# Altium schematic sheet 4-Connectors.schdoc
size 314 x 222 mm
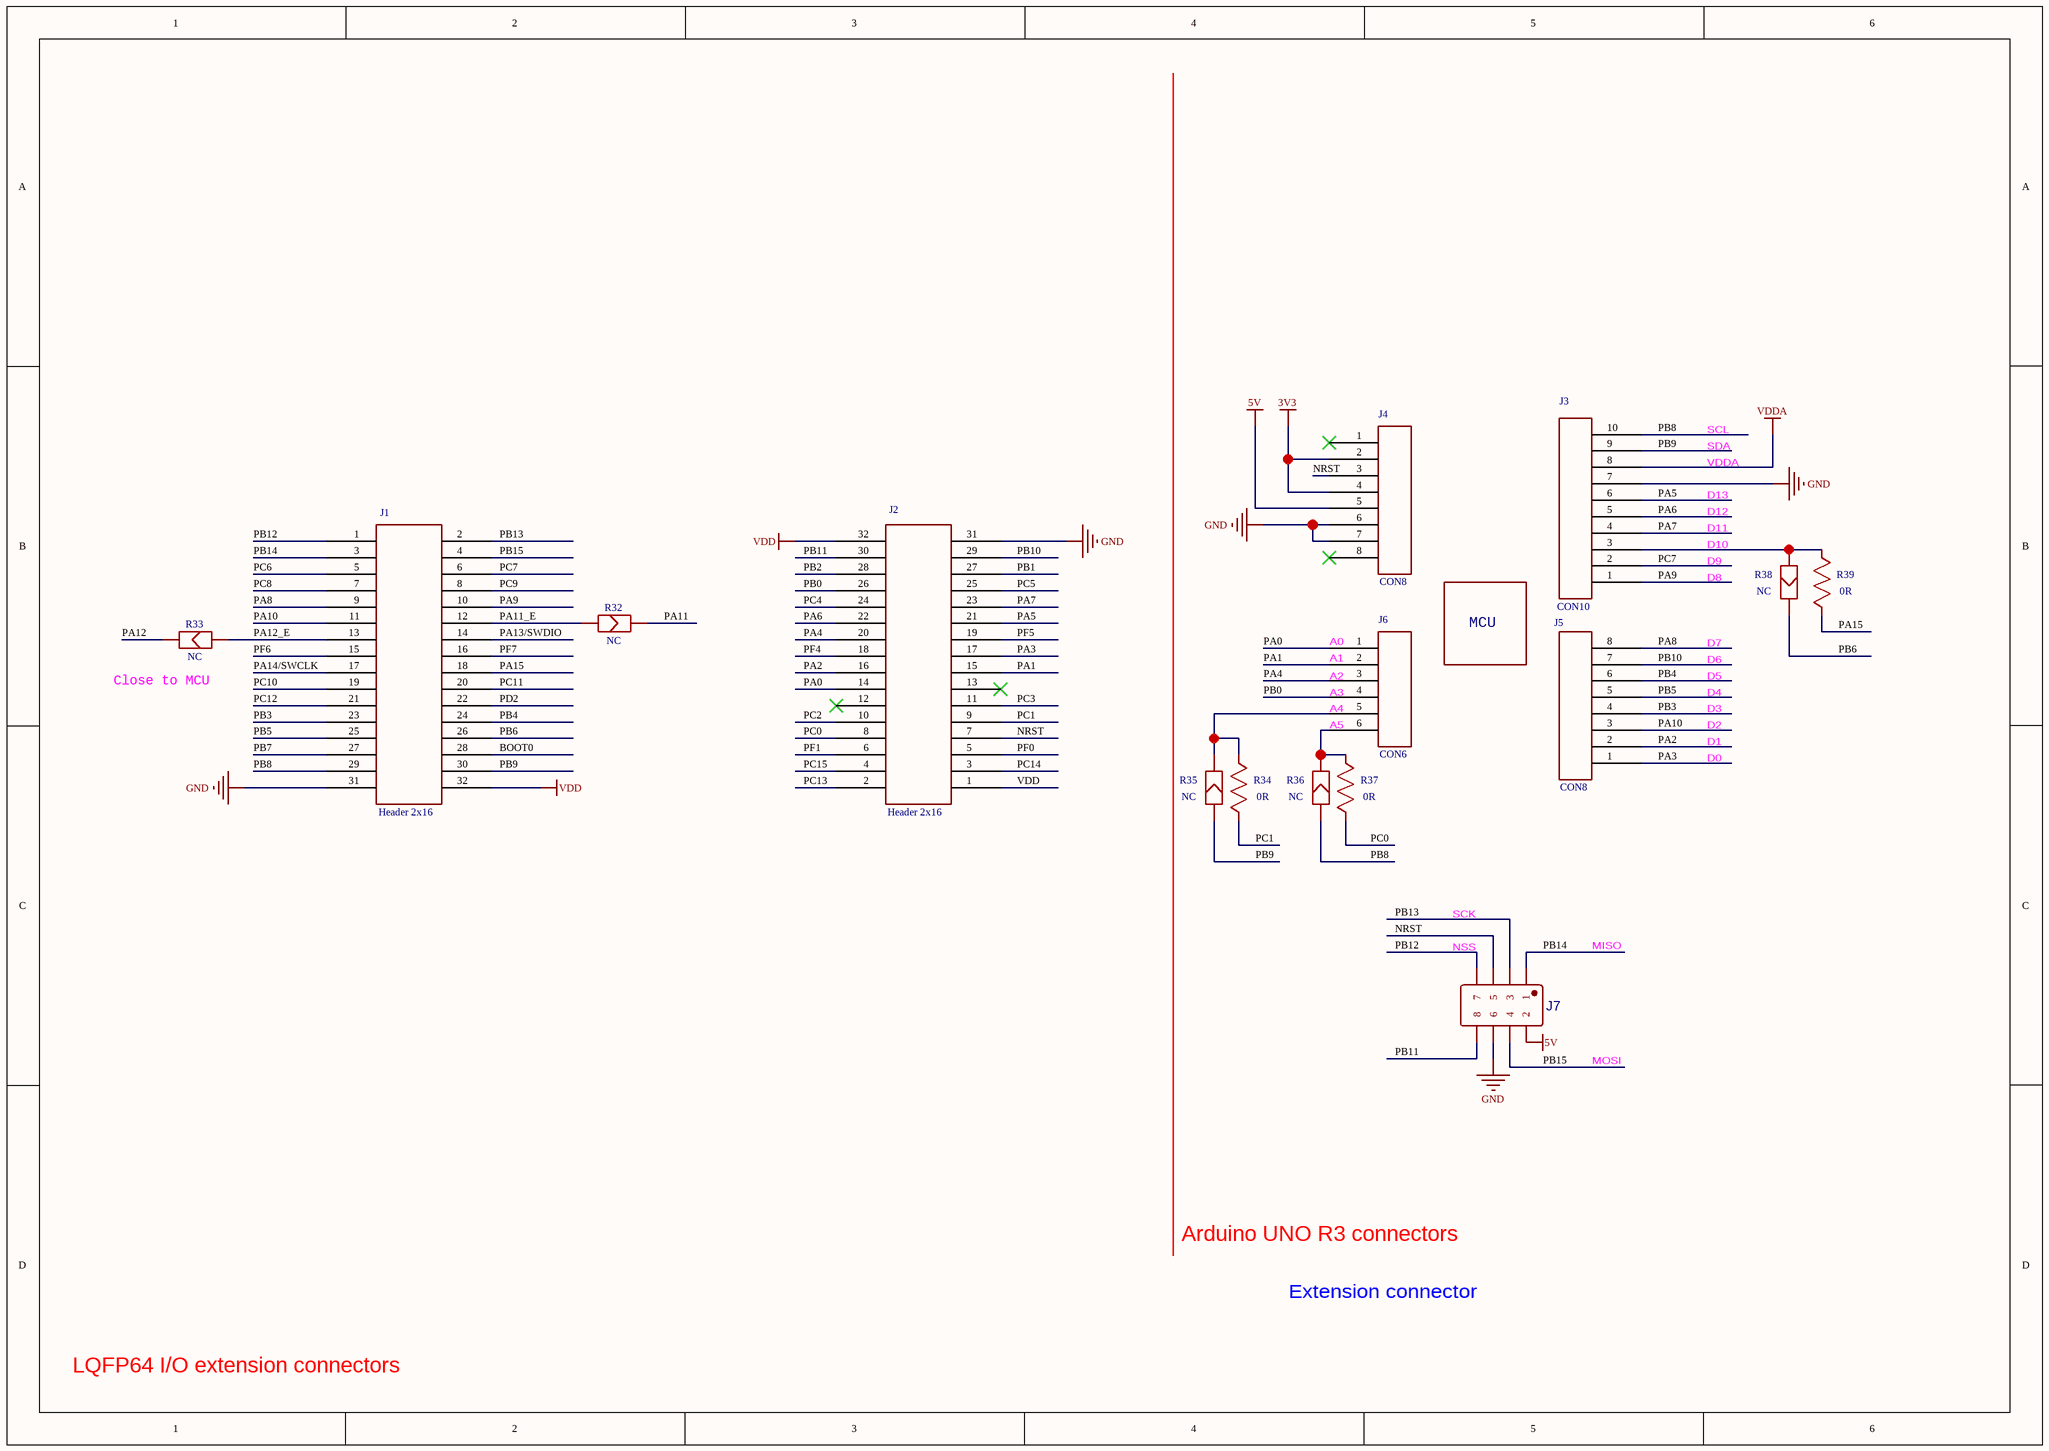
[diagram p0: 4-Connectors.schdoc]

## Parts
J1  Header 2x16  [HDR-M-2.54_2X16]
J2  Header 2x16  [HDR-M-2.54_2X16]
J3  CON10  [FEMALE HEADER 1X10]
J4  CON8  [FEMALE HEADER 1X8]
J5  CON8  [FEMALE HEADER 1X8]
J6  CON6  [FEMALE HEADER 1X6]
J7  Header 4X2  [HDR2X4]  (value not drawn)
R32  NC  [SB-PAD]
R33  NC  [SB-PAD]
R34  0R  [0603_R-M]
R35  NC  [SB-PAD]
R36  NC  [SB-PAD]
R37  0R  [0603_R-M]
R38  NC  [SB-PAD]
R39  0R  [0603_R-M]

## Nets
3V3: J4.2 J4.4
5V: J4.5 J7.2
GND: J1.31 J2.31 J3.7 J4.6 J4.7 J7.6
VDD: J1.32 J2.1 J2.32
VDDA: J3.8
BOOT0: J1.28
NRST: J2.7 J4.3 J7.5
PA0: J2.14 J6.1
PA1: J2.15 J6.2
PA2: J2.16 J5.2
PA3: J2.17 J5.1
PA4: J2.20 J6.3
PA5: J2.21 J3.6
PA6: J2.22 J3.5
PA7: J2.23 J3.4
PA8: J1.9 J5.8
PA9: J1.10 J3.1
PA10: J1.11 J5.3
PA11: R32.2
PA11_E: J1.12 R32.1
PA12: R33.2
PA12_E: J1.13 R33.1
PA13/SWDIO: J1.14
PA14/SWCLK: J1.17
PA15: J1.18 R39.2
PB0: J2.26 J6.4
PB1: J2.27
PB2: J2.28
PB3: J1.23 J5.4
PB4: J1.24 J5.6
PB5: J1.25 J5.5
PB6: J1.26 R38.2
PB7: J1.27
PB8: J1.29 J3.10 R36.1
PB9: J1.30 J3.9 R35.1
PB10: J2.29 J5.7
PB11: J2.30 J7.8
PB12: J1.1 J7.7
PB13: J1.2 J7.3
PB14: J1.3 J7.1
PB15: J1.4 J7.4
PC0: J2.8 R37.2
PC1: J2.9 R34.2
PC2: J2.10
PC3: J2.11
PC4: J2.24
PC5: J2.25
PC6: J1.5
PC7: J1.6 J3.2
PC8: J1.7
PC9: J1.8
PC10: J1.19
PC11: J1.20
PC12: J1.21
PC13: J2.2
PC14: J2.3
PC15: J2.4
PD2: J1.22
PF0: J2.5
PF1: J2.6
PF4: J2.18
PF5: J2.19
PF6: J1.15
PF7: J1.16
NetJ3_3: J3.3 R38.1 R39.1
NetJ6_5: J6.5 R34.1 R35.2
NetJ6_6: J6.6 R36.2 R37.1

Not connected (* = marked no-connect by the designer): J2 12* 13*; J4 1* 8*

## Notes on the sheet
- SCL
- SDA
- VDDA
- D13
- D9
- D10
- D11
- D12
- (near J6) A0
- MCU
- D8
- D7
- (near R33) Close to MCU
- (near J6) A1
- (near J6) A2
- (near J6) A3
- A4
- A5
- D2
- D3
- D4
- D5
- D6
- D0
- D1
- (near J7) SCK
- (near J7) NSS
- MISO
- MOSI
- Arduino UNO R3 connectors
- Extension connector
- LQFP64 I/O extension connectors

## Library data of the parts
J7 = Header 4X2: Contributor: twb17; LatestRevisionDate: 17-Jul-2002; LatestRevisionNote: Re-released for DXP Platform.; Publisher: Altium Limited; spicePre: J; spiceSymbolName: Header 4X2
R32 R33 R35 R36 R38 = NC: Contributor: twb17; spicePre: R; spiceSymbolName: Solder bridge
R34 R37 R39 = 0R: nameAlias: Value(Ω); Contributor: LCEDA_Lib; spicePre: R; spiceSymbolName: R_0603_US